# EAGLE design part 2 (EAGLE 9.6.2)
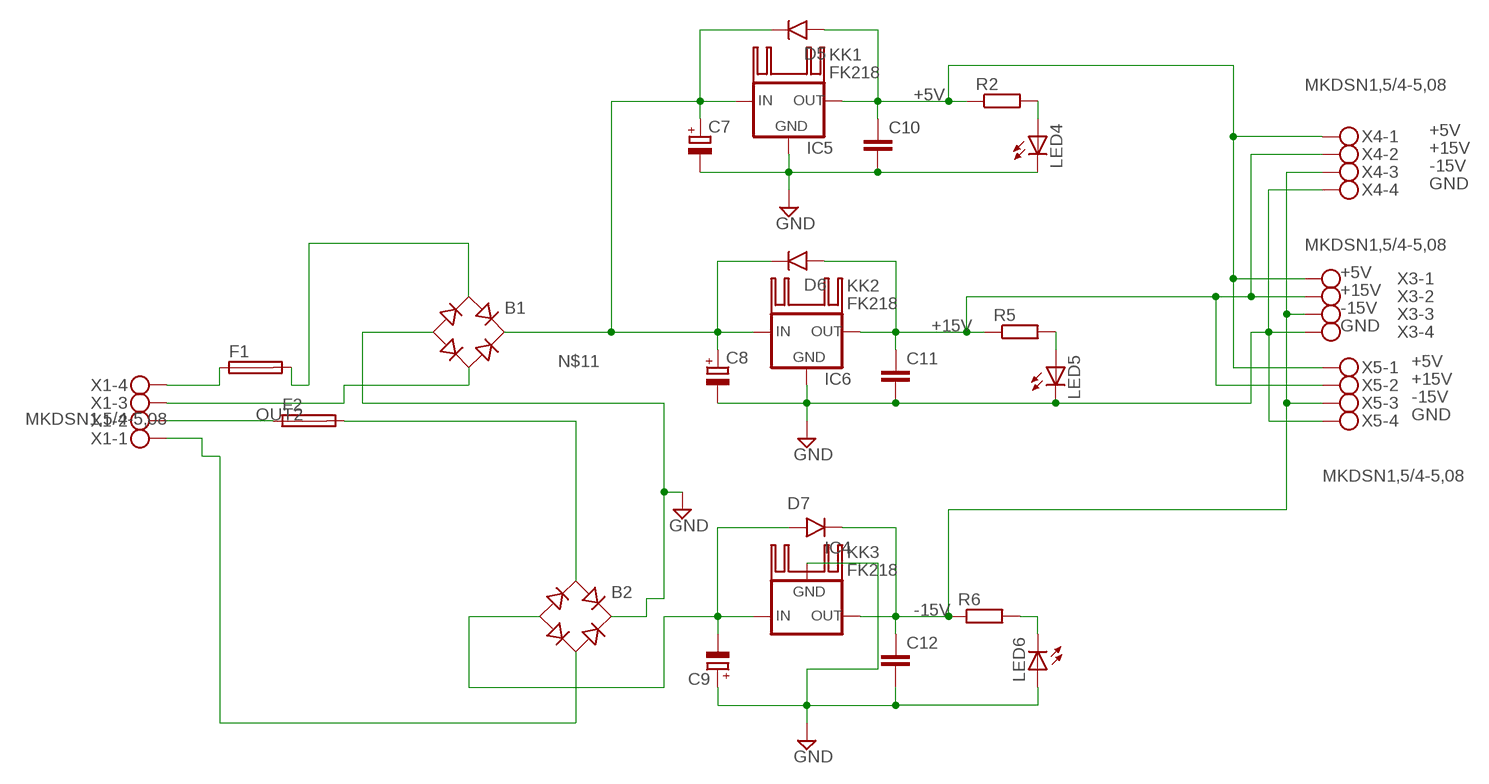
[diagram p0: schematic, sheet 1]

## Parts
B1  RB1A  [RB1A]
B2  RB1A  [RB1A]
C7  CPOL-EUE7.5-18  [E7,5-18]
C8  CPOL-EUE7.5-18  [E7,5-18]
C9  CPOL-EUE7.5-18  [E7,5-18]
C10  C-EU050-025X075  [C050-025X075]
C11  C-EU050-025X075  [C050-025X075]
C12  C-EU050-025X075  [C050-025X075]
D5  1N4001  [DO41-10]
D6  1N4001  [DO41-10]
D7  1N4001  [DO41-10]
F1  SH22,5A  [SH22,5A]
F2  SH22,5A  [SH22,5A]
IC4  79XXS  [79XXS]
IC5  78XXS  [78XXS]
IC6  78XXS  [78XXS]
KK1  FK218  [FK218]
KK2  FK218  [FK218]
KK3  FK218  [FK218]
LED4  LED5MM  [LED5MM]
LED5  LED5MM  [LED5MM]
LED6  LED5MM  [LED5MM]
R2  R-EU_0207/15  [0207/15]
R5  R-EU_0207/15  [0207/15]
R6  R-EU_0207/15  [0207/15]
X1  MKDSN1,5/4-5,08  [MKDSN1,5/4-5,08]
X3  MKDSN1,5/4-5,08  [MKDSN1,5/4-5,08]
X4  MKDSN1,5/4-5,08  [MKDSN1,5/4-5,08]
X5  MKDSN1,5/4-5,08  [MKDSN1,5/4-5,08]

## Nets
+5V: C10.1 D5.A(ANODE) IC5.OUT R2.1 X3.1 X4.1 X5.1
+15V: C11.1 D6.A(ANODE) IC6.OUT R5.1 X3.2 X4.2 X5.2
-15V: C12.1 D7.C(CATHODE) IC4.OUT R6.1 X3.3 X4.3 X5.3
GND: B1.- B2.+ C7.- C8.- C9.+ C10.2 C11.2 C12.2 IC4.GND IC5.GND IC6.GND LED4.K(C) LED5.K(C) LED6.A X3.4 X4.4 X5.4
N$1: B1.AC1 F1.2
N$2: F1.1 X1.4
N$3: F2.1 X1.2
N$5: B2.AC2 X1.1
N$7: LED5.A R5.2
N$8: B2.- C9.- D7.A(ANODE) IC4.IN
N$11: B1.+ C7.+ C8.+ D5.C(CATHODE) D6.C(CATHODE) IC5.IN IC6.IN
N$12: B2.AC1 F2.2
N$15: LED4.A R2.2
N$16: LED6.K(C) R6.2
OUT2: B1.AC2 X1.3
Unconnected: KK1.A2,2(K) KK1.B2,2(K) KK2.A2,2(K) KK2.B2,2(K) KK3.A2,2(K) KK3.B2,2(K)

## Library data of the parts
B1 B2 = rectifier:RB1A: RECTIFIER 1 A
C7-C9 = rcl:CPOL-EU: POLARIZED CAPACITOR, European symbol
C10-C12 = rcl:C-EU: CAPACITOR, European symbol
D5-D7 = tango:1N4001: DIODE general purpose rectifier, 1 A
F1 F2 = fuse:SH22,5A: FUSE HOLDER grid 22,5mm, isolated cap OGN0031 8201, Schurter (Buerklin); MPN: 0031.7701.11; OC_FARNELL: unknown; OC_NEWARK: 04F1224
IC4 = v-reg:79XXS: VOLTAGE REGULATOR
IC5 IC6 = v-reg:78XXS: VOLTAGE REGULATOR
KK1-KK3 = heatsink:FK218: HEATSINK manufacturer Fischer/distributor Buerklin
LED4-LED6 = led:LED: LED OSRAM: - CHIPLED LG R971, LG N971, LY N971, LG Q971, LY Q971, LO R971, LY R971 LH N974, LH R974 LS Q976, LO Q976, LY Q976 LO Q996 - Hyper CHIPLED LW Q18S LB Q993, LB Q99A, LB R99A - SideLED LS A670, LO A670, LY A670, LG A670, LP A670 LB A673, LV A673, LT A673, LW A673 LH A674 LY A675 LS A676, LA A676, LO A676, LY A676, LW A676 LS A679, LY A679, LG A679 - Hyper Micro SIDELED® LS Y876, LA Y876, LO Y876, LY Y876 LT Y87S - SmartLED LW L88C, LW L88S LB L89C, LB L89S, LG L890 LS L89K, LO L89K, LY L89K LS L896, LA L896, LO L896, LY L896 - TOPLED LS T670, LO T670, LY T670, LG T670, LP T670 LSG T670, LSP T670, LSY T670, LOP T670, LYG T670 LG T671, LOG T671, LSG T671 LB T673, LV T673, LT T673, LW T673 LH T674 LS T676, LA T676, LO T676, LY T676, LB T676, LH T676, LSB T676, LW T676 LB T67C, LV T67C, LT T67C, LS T67K, LO T67K, LY T67K, LW E67C LS E67B, LA E67B, LO E67B, LY E67B, LB E67C, LV E67C, LT E67C LW T67C LS T679, LY T679, LG T679 LS T770, LO T770, LY T770, LG T770, LP T770 LB T773, LV T773, LT T773, LW T773 LH T774 LS E675, LA E675, LY E675, LS T675 LS T776, LA T776, LO T776, LY T776, LB T776 LHGB T686 LT T68C, LB T68C - Hyper Mini TOPLED® LB M676 - Mini TOPLED Santana® LG M470 LS M47K, LO M47K, LY M47K Source: http://www.osram.convergy.de LUXEON: - LUMILED® LXK2-PW12-R00, LXK2-PW12-S00, LXK2-PW14-U00, LXK2-PW14-V00 LXK2-PM12-R00, LXK2-PM12-S00, LXK2-PM14-U00 LXK2-PE12-Q00, LXK2-PE12-R00, LXK2-PE12-S00, LXK2-PE14-T00, LXK2-PE14-U00 LXK2-PB12-K00, LXK2-PB12-L00, LXK2-PB12-M00, LXK2-PB14-N00, LXK2-PB14-P00, LXK2-PB14-Q00 LXK2-PR12-L00, LXK2-PR12-M00, LXK2-PR14-Q00, LXK2-PR14-R00 LXK2-PD12-Q00, LXK2-PD12-R00, LXK2-PD12-S00 LXK2-PH12-R00, LXK2-PH12-S00 LXK2-PL12-P00, LXK2-PL12-Q00, LXK2-PL12-R00 Source: www.luxeon.com KINGBRIGHT: KA-3528ASYC Source: www.kingbright.com
R2 R5 R6 = rcl:R-EU_: RESISTOR, European symbol
X1 X3-X5 = con-phoenix-508:MKDSN1,5/4-5,08: MKDSN 1,5/ 4-5,08 Printklemme Nennstrom: 13,5 A Nennspannung: 250 V Rastermaß: 5,08 mm Polzahl: 4 Anschlussart: Schraubanschluss Montage: Löten Anschlussrichtung Leiter/Platine: 0 ° Artikelnummer: 1729144 Source: http://eshop.phoenixcontact.com .. 1729144.pdf

## Board
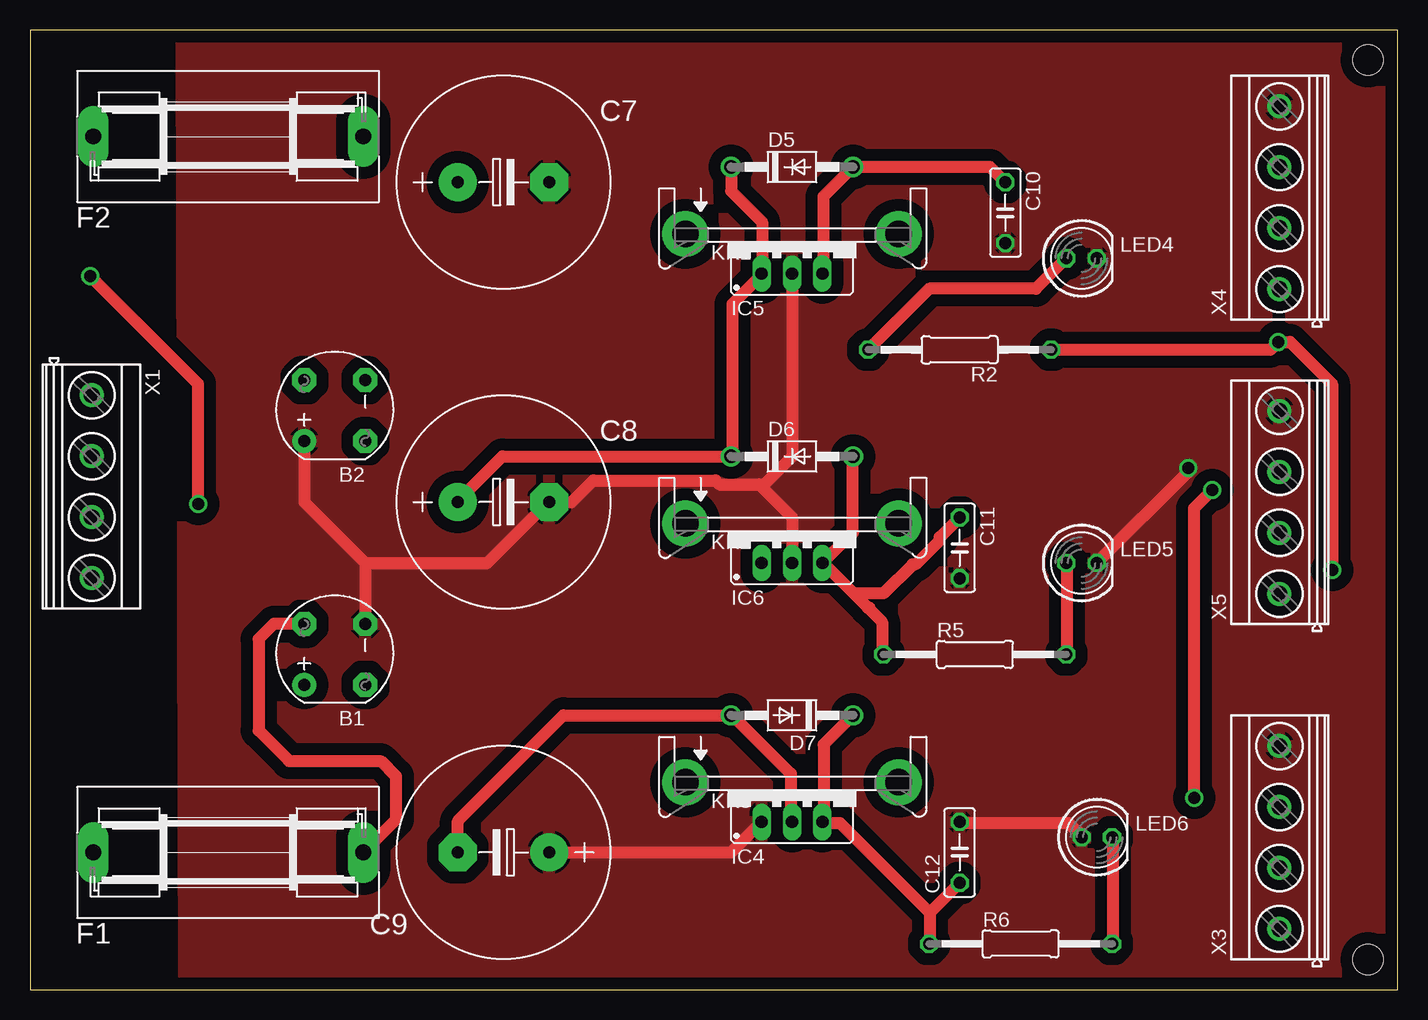
[diagram p1: board, top side]
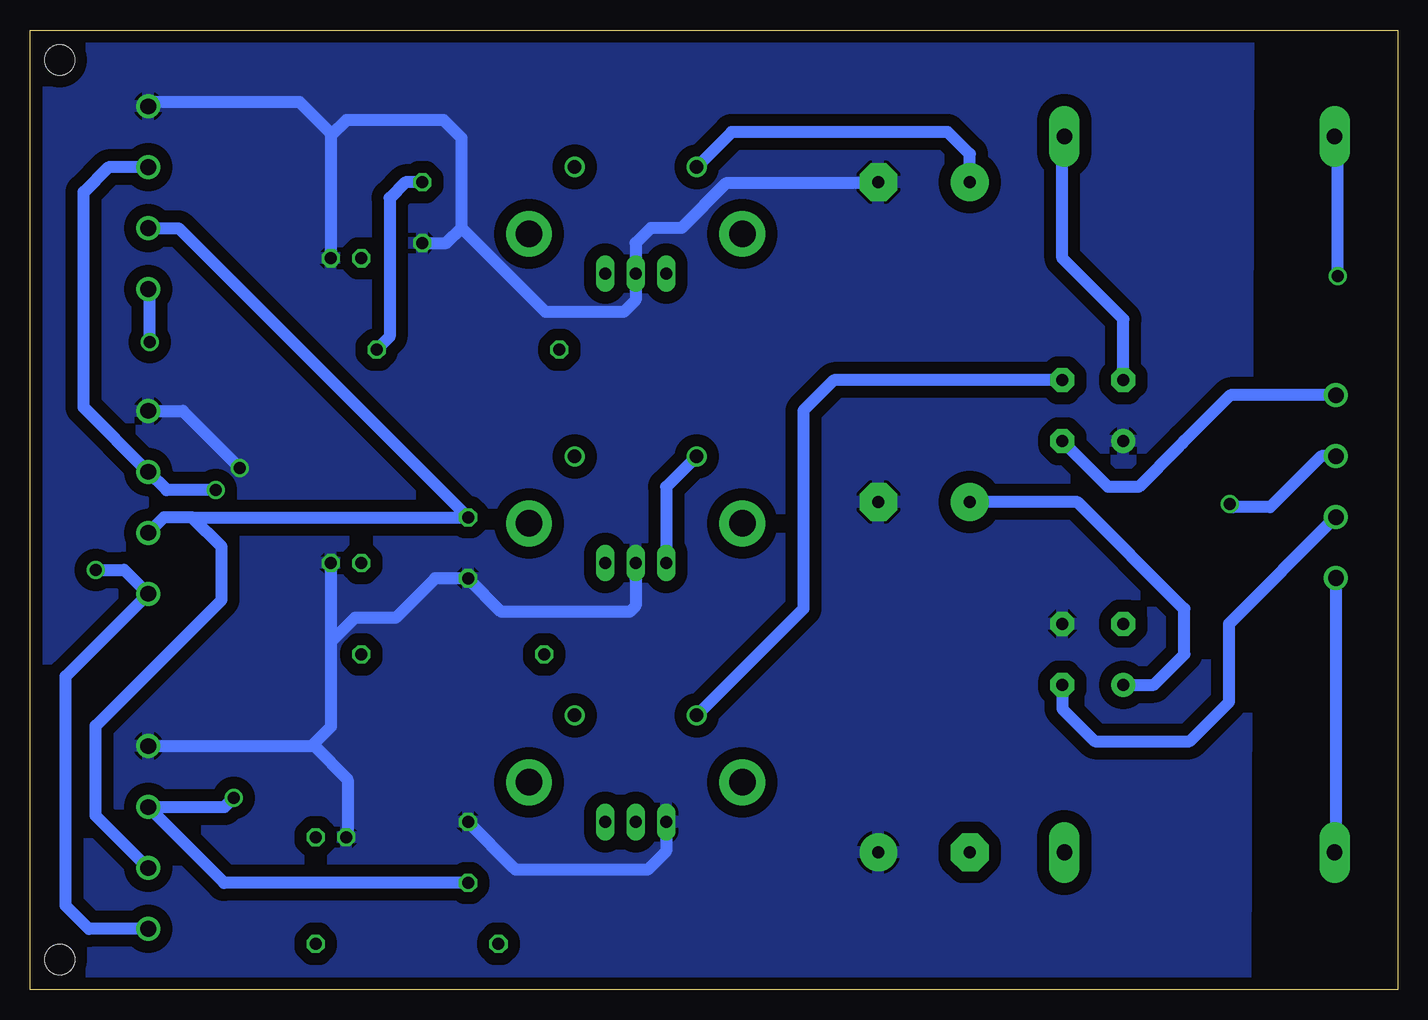
[diagram p2: board, bottom side, seen from below]

Size 113.97 x 80 mm. Coordinates in mm from the lower left corner, seen from the top.
Outline: 0,0 113.97,0 113.97,80 0,80 0,0
Copper layers (1*16): Top 0.035mm / dielectric 1.5mm / Bottom 0.035mm
Design rules "default *": minimum track width 0.8mm, minimum drill 1mm, track to track 1mm, track to pad 1mm, pad to pad 1mm, via to via 1mm, smd to smd 1mm, copper to edge 40mil, drill to drill 6mil, minimum pad ring 10mil, minimum via ring 8mil, stop-mask expansion 4mil, vias tented up to drill 0mil, thermal gap 10mil
Holes 2.5 mm at 111.5,2.5 111.5,77.5

### Footprints (pad centres in the part's own frame; a part is rotated, then mirrored left to right if it is on the bottom)
RB1A = drill 1.016 pad 2: + -2.54,2.54 | drill 1.016 pad 2 octagon: - 2.54,-2.54; AC1 2.54,2.54; AC2 -2.54,-2.54
E7,5-18 = drill 1 pad 3.15: + -3.81,0 | drill 1 pad 3.15 octagon: - 3.81,0
C050-025X075 = drill 1 octagon: 1 -2.54,0; 2 2.54,0
DO41-10 = drill 1.118: A 5.08,0; C -5.08,0
SH22,5A = drill 1.321 pad 2.54 long: 1 -11.252,0; 2 11.252,0
79XXS = drill 1.016 long: GND -2.54,-2.54; IN 0,-2.54; OUT 2.54,-2.54
78XXS = drill 1.016 long: GND 0,-2.54; IN -2.54,-2.54; OUT 2.54,-2.54
FK218 = drill 2.21 pad 3.81: A2,2 -8.89,-0.508; B2,2 8.89,-0.508
LED5MM = drill 1 octagon: A -1.27,0; K 1.27,0
0207/15 = drill 1 octagon: 1 -7.62,0; 2 7.62,0
MKDSN1,5/4-5,08 = drill 1.3 pad 2: 1 -7.641,0.025; 2 -2.561,0.025; 3 2.519,0.025; 4 7.599,0.025

### Placement (x,y rotation side)
B1  25.4,27.94 90 top
B2  25.4,48.26 90 top
C7  39.46,67.31 0 top
C8  39.46,40.64 0 top
C9  39.46,11.43 180 top
C10  81.28,64.77 270 top
C11  77.47,36.83 270 top
C12  77.47,11.43 90 top
D5  63.5,68.58 0 top
D6  63.5,44.45 0 top
D7  63.5,22.86 180 top
F1  16.51,11.43 0 top
F2  16.51,71.12 0 top
IC4  63.5,16.51 0 top
IC5  63.5,62.23 0 top
IC6  63.5,38.1 0 top
KK1  63.5,63.5 0 top
KK2  63.5,39.37 0 top
KK3  63.5,17.78 0 top
LED4  87.63,60.96 0 top
LED5  87.63,35.56 0 top
LED6  88.9,12.7 0 top
R2  77.47,53.34 180 top
R5  78.74,27.94 0 top
R6  82.55,3.81 0 top
X1  5.12,41.91 270 top
X3  104.14,12.7 90 top
X4  104.14,66.04 90 top
X5  104.14,40.64 90 top

### Tracks (layer width: path | path; a pad name or v marks a point on that pad's centre or on a via)
+5V  (via drill 1)
  Top 1: v104,54 105,54 108.5,50.5 v108.5,35
  Top 1.016: C10.1 80.01,68.58 D5.A 66.14,66.14 66.14,59.74 66.09,59.69 IC5.OUT | R2.1 103.34,53.34 v104,54
  Bottom 1: 104.11,54.12 v104,54 | v108.5,35 106.12,35 X5.1
  Bottom 1.016: X3.1 109.06,5.06 111,7 111,26.11 X5.1 | v104,54 104,58.28 X4.1 | C10.1 82.69,67.31 84,66 84,54.43 R2.1
+15V
  Top 1: 71.14,33.05 73.56,35.46 73.8,35.46 75.8,37.45 75.8,37.7 C11.1
  Top 1.016: 68.61,33.05 66.14,35.51 IC6.OUT 68.58,38.1 D6.A | 68.61,33.05 69.8,31.85 | 69.8,31.85 71.02,30.63 71.02,28.04 R5.1 | 69.8,31.85 69.95,31.85 | 68.61,33.05 71.14,33.05
  Bottom 1.016: 100.47,39.37 C11.1 101.58,63.48 X4.2 | 100.47,39.37 102.82,39.37 X5.2 | X3.2 104.14,10.14 108.5,14.5 108.5,22 98,32.5 98,36.9 100.47,39.37
-15V  (via drill 1)
  Top 1: v97,16 97,40.13 v98.5,41.63
  Top 1.016: D7.C 66.14,20.42 66.14,14.02 IC4.OUT 66.14,13.87 67.51,13.87 74.98,6.4 | 74.98,6.4 74.98,3.81 R6.1 | C12.1 74.98,6.4
  Bottom 1: X3.3 97.78,15.22 v97,16 | v98.5,41.63 102.58,41.63 X5.3
  Bottom 1.016: C12.1 97.79,8.89 X3.3 | X4.3 107.44,68.56 109.5,66.5 109.5,48.54 X5.3
GND  (via drill 1)
  Top 1: IC5.GND 63.5,44.45 60.96,41.91 60.76,42.11 57.45,42.11 57.12,42.44 46.94,42.44 45.14,40.64 C8.-
  Top 1.016: C12.2 77.57,13.87 86.56,13.87 87.63,12.8 LED6.A | 43.28,40.69 C8.- 43.18,40.64 38.1,35.56 27.94,35.56 | 60.96,41.91 63.5,39.37 IC6.GND | C9.+ 58.42,11.43 IC4.GND | B2.+ 22.86,40.64 27.94,35.56 | 27.94,35.56 B1.- | v96.5,43.5 96.5,43.16 LED5.K
  Bottom 1: IC5.GND 63.5,57.5 64.5,56.5 71,56.5 78,63.5 | 63.5,34.29 63.5,32 64,31.5 74.68,31.5 C11.2 | 60.96,12.7 60.96,11.54 62.5,10 73.5,10 73.66,10.16
  Bottom 1.016: C7.- 43.28,67.21 55.98,67.21 59.69,63.5 62.23,63.5 63.5,62.23 IC5.GND 63.4,59.74 | IC4.GND 60.96,12.7 | 73.66,10.16 C12.2 | IC6.GND 63.5,34.29 | 88.9,71.19 LED4.K | 88.9,71.19 88.9,71.4 91.5,74 103.75,74 X4.4 | X5.4 101.24,48.24 v96.5,43.5 | C10.2 79.27,62.23 78,63.5 78,71 79.5,72.5 87.59,72.5 88.9,71.19 | X3.4 90.5,20.3 | 90.5,20.3 90.3,20.3 87.5,17.5 87.5,12.83 LED6.A | LED5.K 88.9,29 | 88.9,29 88.9,21.9 90.5,20.3 | C11.2 80.21,34.29 83.5,31 86.9,31 88.9,29
  pour Top: 12.59,80 12.81,-0.23 114.3,0 114.3,80.01
  pour Bottom: 12.47,80.01 12.69,-0.22 114.3,0 114.3,80.01
N$1
  Top 1.016: B1.AC1 20.32,30.48 19.05,29.21 19.05,21.59 21.59,19.05 29.21,19.05 30.48,17.78 30.48,14.15 F1.2
N$2
  Bottom 1.016: X1.4 5.14,11.54 F1.1
N$3  (via drill 1)
  Top 1.016: v14,40.5 14,50.5 v5,59.5
  Bottom 1.016: 13.84,40.66 v14,40.5 13.71,40.21 10.62,40.21 6.36,44.47 X1.2 | v5,59.5 5,70.86 F2.1
N$5
  Bottom 1.016: 17.8,45.74 17.8,45.7 | 18.28,45.22 17.8,45.7 | 18.28,45.22 21.59,41.91 24.13,41.91 B2.AC2 | 17.8,45.7 | X1.1 13.95,49.55 18.28,45.22
N$7
  Top 1.016: R5.2 86.41,28.04 86.41,35.51 LED5.A
N$8
  Top 1.016: IC4.IN 63.4,14.02 63.4,17.98 58.52,22.86 D7.A 44.45,22.86 35.65,14.06 C9.-
  Bottom 1.016: B2.- 46.99,50.8 49.53,48.26 49.53,31.75 D7.A
N$11
  Top 1.016: 60.96,59.59 58.52,57.15 58.52,44.5 D6.C 39.37,44.45 35.65,40.73 C8.+ | IC5.IN 60.96,59.59 | D5.C 58.42,66.58 61,64 61,59.63 60.96,59.59
  Bottom 1.016: 35.51,40.54 C8.+ 26.67,40.64 17.78,31.75 17.78,27.94 20.32,25.4 B1.+ | IC6.IN 60.96,41.91 D6.C | C7.+ 35.65,69.65 37.5,71.5 55.5,71.5 D5.C
N$12
  Bottom 1.016: B2.AC1 22.86,55.88 27.94,60.96 27.94,70.94 F2.2
N$15
  Top 1.016: LED4.A 83.82,58.42 74.93,58.42 R2.2
N$16
  Top 1.016: R6.2 90.22,3.81 90.22,12.65 LED6.K
OUT2
  Bottom 1.016: B1.AC2 27.94,23.41 25.23,20.7 17.34,20.7 14.05,23.99 14.05,30.49 X1.3